# EAGLE design GDEnvSensorNode_Programmer (EAGLE 8.2.1)
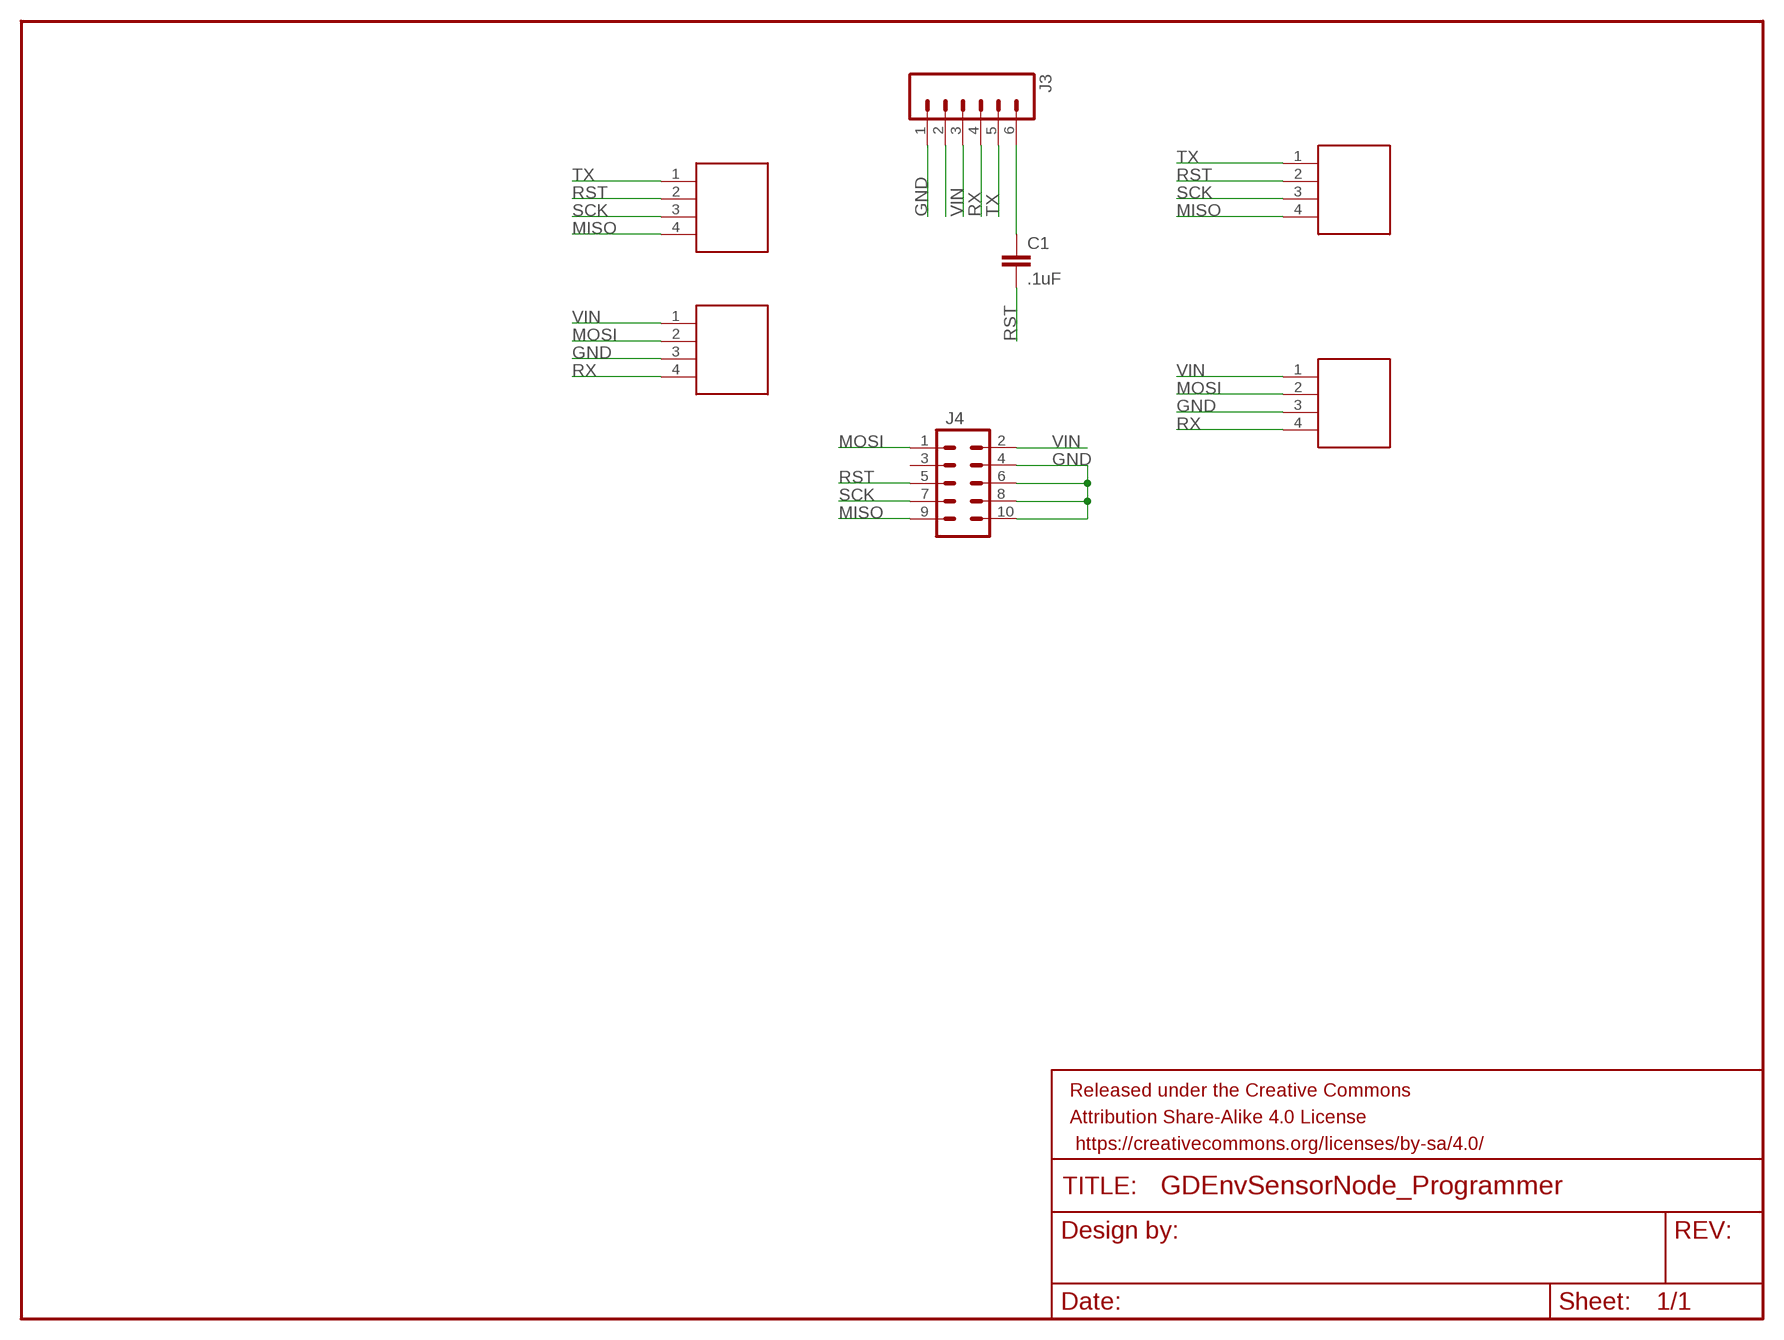
[diagram p0: schematic, sheet 1]

## Parts
C1  .1uF  CAP0805  [0805]
FRAME1  FRAME-LETTER  [CREATIVE_COMMONS]
J1  4X.1IN_POGO_PIN  [4X.1IN_POGO_PIN]
J2  4X.1IN_POGO_PIN  [4X.1IN_POGO_PIN]
J3  M06LONGPADS  [1X06_LONGPADS]
J4  M05X2PTH  [AVR_ICSP]
J5  4X.1IN_POGO_PIN  [4X.1IN_POGO_PIN]
J6  4X.1IN_POGO_PIN  [4X.1IN_POGO_PIN]

## Nets
GND: J2.3 J3.1 J4.4 J4.6 J4.8 J4.10 J6.3
MISO: J1.4 J4.9 J5.4
MOSI: J2.2 J4.1 J6.2
N$1: C1.1 J3.6
N$14: J3.2
RST: C1.2 J1.2 J4.5 J5.2
RX: J2.4 J3.4 J6.4
SCK: J1.3 J4.7 J5.3
TX: J1.1 J3.5 J5.1
VIN: J2.1 J3.3 J4.2 J6.1
Unconnected: J4.3

## Library data of the parts
C1 = SparkFun-Capacitors:CAP: Capacitor Standard 0603 ceramic capacitor, and 0.1" leaded capacitor.
FRAME1 = SparkFun-Aesthetics:FRAME-LETTER: Schematic Frame Standard 8.5x11 US Letter frame
J1 J2 J5 J6 = GDTech:4X.1IN_POGO_PIN: 4x.1in spacing 1.02mm diameter pogo pins P75-B1 Dia 1.02mm 100g Spring Test Probe Pogo Pin found on eBay.
J3 = SparkFun-Connectors:M06: Header 6 Standard 6-pin 0.1" header. Use with straight break away headers (SKU : PRT-00116), right angle break away headers (PRT-00553), swiss pins (PRT-00743), machine pins (PRT-00117), and female headers (PRT-00115). Molex polarized connector foot print use with SKU : PRT-08094 with associated crimp pins and housings. NOTES ON THE VARIANTS LOCK and LOCK_LONGPADS... This footprint was designed to help hold the alignment of a through-hole component (i.e. 6-pin header) while soldering it into place. You may notice that each hole has been shifted either up or down by 0.005 of an inch from it's more standard position (which is a perfectly straight line). This slight alteration caused the pins (the squares in the middle) to touch the edges of the holes. Because they are alternating, it causes a "brace" to hold the component in place. 0.005 has proven to be the perfect amount of "off-center" position when using our standard breakaway headers. Although looks a little odd when you look at the bare footprint, once you have a header in there, the alteration is very hard to notice. Also,if you push a header all the way into place, it is covered up entirely on the bottom side. This idea of altering the position of holes to aid alignment will be further integrated into the Sparkfun Library for other footprints. It can help hold any component with 3 or more connection pins.
J4 = SparkFun-Connectors:M05X2: Header 5x2 Standard 10-pin dual row 0.1" header. Commonly used with AVR-ISP. Use with Spark Fun Electronics SKU: PRT-00778

## Board
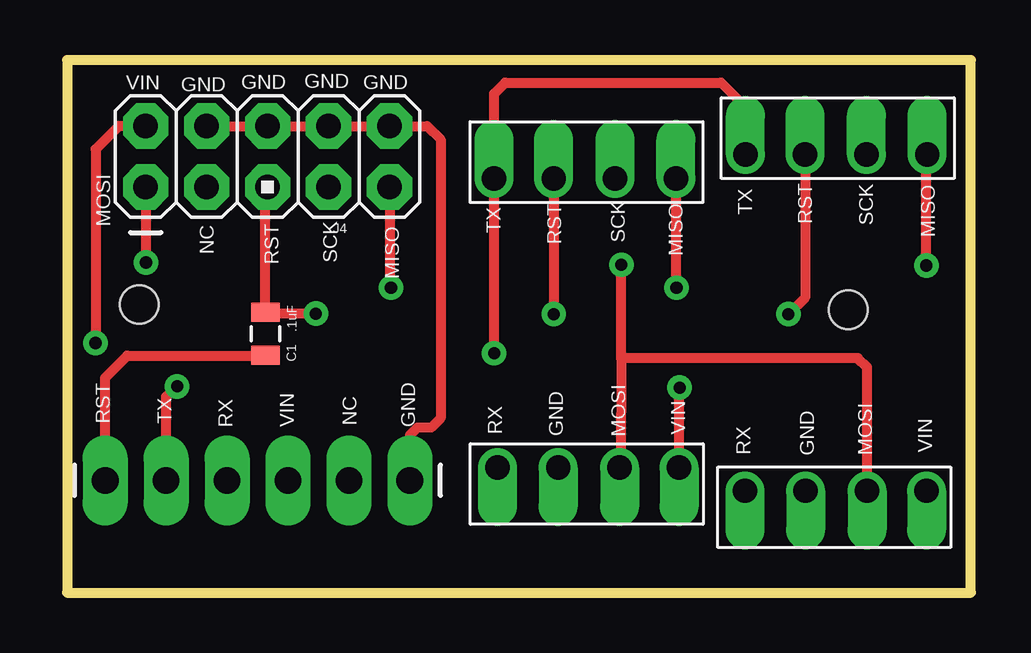
[diagram p1: board, top side]
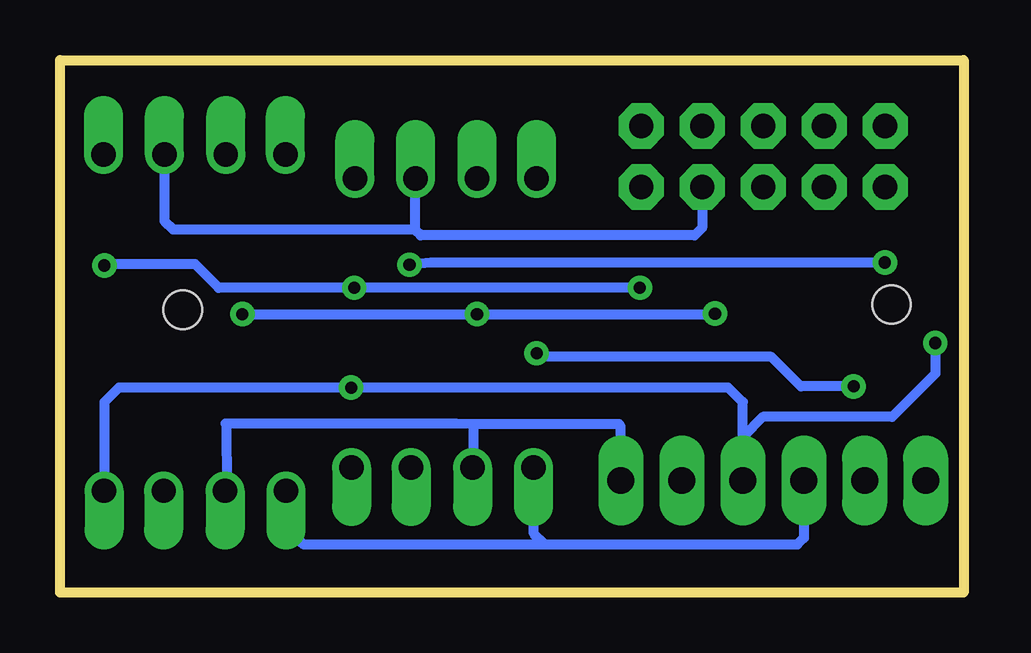
[diagram p2: board, bottom side, seen from below]

Size 37.65 x 22.19 mm. Coordinates in mm from the lower left corner, seen from the top.
Outline: 0,0 37.65,0 37.65,22.19 0,22.19 0,0
Copper layers (1*16): Top 0.035mm / dielectric 1.5mm / Bottom 0.035mm
Design rules "SparkFun": minimum track width 8mil, minimum drill 20mil, track to track 8mil, track to pad 8mil, pad to pad 8mil, via to via 8mil, smd to smd 8mil, copper to edge 8mil, drill to drill 8mil, minimum pad ring 12mil, minimum via ring 10mil, stop-mask expansion 4mil, vias tented up to drill 20mil, thermal gap 10mil
Holes 1.6 mm at 3,12 32.54,11.79

### Footprints (pad centres in the part's own frame; a part is rotated, then mirrored left to right if it is on the bottom)
0805 = smd 0.8 x 1.2: 1 -0.9,0; 2 0.9,0
4X.1IN_POGO_PIN = drill 1.016 pad 1.422 offset: 1 0,9.27; 2 0,6.787; 3 0,4.229; 4 0,1.695
1X06_LONGPADS = drill 1.118 pad 1.88 long: 1 0,0; 2 2.54,0; 3 5.08,0; 4 7.62,0; 5 10.16,0; 6 12.7,0
AVR_ICSP = drill 1.016 pad 1.88 octagon: 1 -1.27,5.08; 2 1.27,5.08; 3 -1.27,2.54; 4 1.27,2.54; 5 -1.27,0; 6 1.27,0; 7 -1.27,-2.54; 8 1.27,-2.54; 9 -1.27,-5.08; 10 1.27,-5.08

### Placement (x,y rotation side)
C1  8.26,10.79 90 top
FRAME1  19.84,-12.64 0 top  (outside the outline)
J1  27.06,17.25 90 top
J2  16.23,5.21 270 top
J3  14.28,4.67 180 top
J4  8.35,18.17 90 top
J5  37.53,18.25 90 top
J6  26.54,4.24 270 top

### Tracks (layer width: path | path; a pad name or v marks a point on that pad's centre or on a via)
GND
  Top 0.406: J4.4 J4.6 J4.8 J4.10 15,19.44 15.56,18.88 15.56,7.27 15.16,6.87 14.59,6.87 14.29,6.57 J3.1
  Bottom 0.406: 30.76,7.04 30.73,7.05 | 30.73,7.05 21.15,7.05 20.48,7.03 | 20.48,7.03 20.44,6.99 20.44,5.23 J2.3 | 20.48,7.03 14.36,7.03 14.31,6.97 14.31,4.7 J3.1 | 30.73,7.05 30.7,4.31 J6.3
MISO  (via drill 0.51 pad 1.02)
  Top 0.406: J4.9 13.43,12.76 v13.49,12.7 | v35.8,13.63 35.8,18.21 J5.4 | J1.4 25.36,12.73 v25.39,12.7
  Bottom 0.406: v13.49,12.7 v25.39,12.7 31.04,12.7 32.02,13.68 35.75,13.68 v35.8,13.63
MOSI  (via drill 0.51 pad 1.02)
  Top 0.406: J4.1 3.27,13.85 3.25,13.83 3.25,13.78 v3.28,13.75 | 23.08,9.75 v23.09,13.66 | 23.08,9.75 23.07,5.26 J2.2 | J6.2 33.33,9.39 32.95,9.77 23.1,9.77 23.08,9.75
  Bottom 0.406: v3.28,13.75 22.2,13.75 v23.09,13.66
N$1
  Top 0.406: J3.6 1.58,8.95 2.5,9.87 8.24,9.87 C1.1
RST  (via drill 0.51 pad 1.02)
  Top 0.406: J4.5 8.26,16.81 C1.2 8.32,11.62 v10.36,11.62 | J1.2 20.27,11.64 | 20.27,11.64 20.29,11.62 | J5.2 30.74,12.29 v30.05,11.6 | 20.27,11.64 v20.27,11.6
  Bottom 0.406: v30.05,11.6 v20.27,11.6 10.38,11.6 v10.36,11.62
RX
  Bottom 0.406: J3.4 6.66,2.28 6.93,2.01 17.46,2.01 | 17.46,2.01 17.91,2.46 17.91,5.2 J2.4 | J6.4 28.23,2.64 27.49,2.01 17.46,2.01
SCK
  Bottom 0.406: J4.7 10.89,15.2 11.21,14.88 22.62,14.88 22.84,15.1 | 22.84,15.1 J1.3 | J5.3 33.3,15.48 32.95,15.13 22.87,15.13 22.84,15.1
TX  (via drill 0.51 pad 1.02)
  Top 0.406: J5.1 28.25,20.25 27.25,21.25 18.25,21.25 17.79,20.79 J1.1 v17.79,9.97 | J3.5 4.12,8.16 4.5,8.54 4.53,8.54 v4.58,8.59
  Bottom 0.406: v4.58,8.59 6.78,8.59 8.01,9.82 17.64,9.82 v17.79,9.97
VIN  (via drill 0.51 pad 1.02)
  Top 0.406: J4.2 2.14,19.44 1.18,18.48 v1.18,10.4 | J2.1 25.5,8.52 v25.52,8.54
  Bottom 0.406: v1.18,10.4 1.18,9.12 2.98,7.32 8.36,7.32 9.21,6.47 J3.3 9.2,7.93 9.81,8.54 v25.52,8.54 35.2,8.54 35.8,7.94 J6.1

### Text on the board
tPlace: VIN | GND | GND | GND | GND | MOSI | TX | TX | RST | SCK | MISO | NC | SCK | RST | SCK | MISO | RST | MISO | RST | TX | RX | VIN | NC | GND | RX | GND | MOSI | VIN | RX | VIN | GND | MOSI